# Altium schematic sheet MAIN-MODULE.SchDoc
size A; SheetNumber: 1; SheetTotal: 8
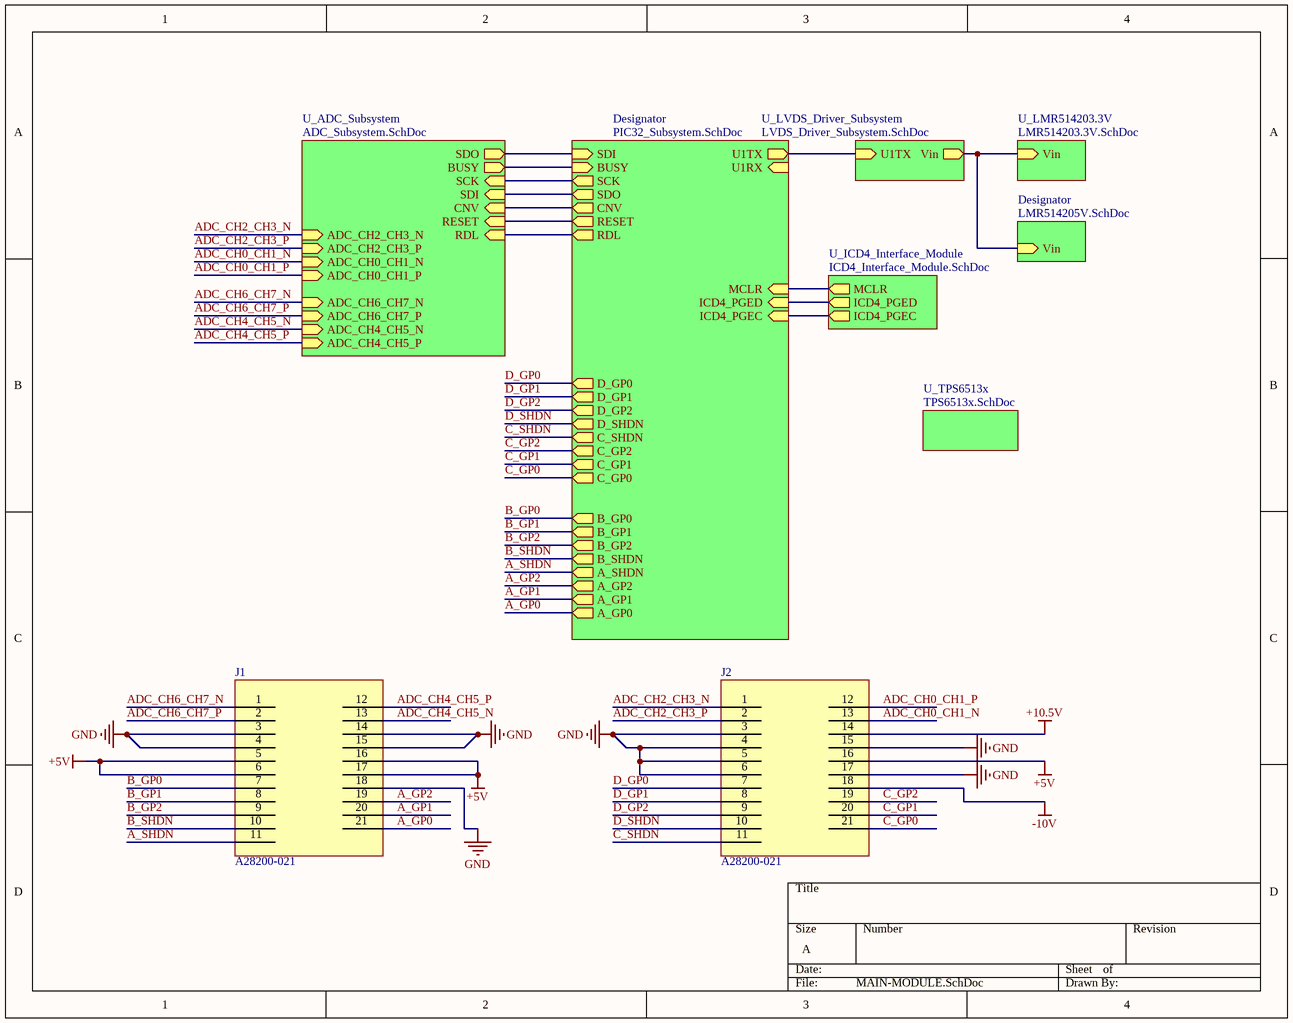
[diagram p0: MAIN-MODULE.SchDoc]

## Parts
J1  A28200-021  [A28200-021]
J2  A28200-021  [A28200-021]

## Sub-sheets
Designator = PIC32_Subsystem.SchDoc: ICD4_PGED (in), ICD4_PGEC (in), MCLR (in), SCK (out), U1RX (in), SDO (out), RESET (out), SDI (in), U1TX (out), BUSY (in), CNV (out), RDL (out), C_GP1 (out), C_GP2 (out), C_GP0 (out), C_SHDN (out), A_GP2 (out), A_GP0 (out), A_GP1 (out), A_SHDN (out), D_SHDN (out), D_GP0 (out), D_GP1 (out), D_GP2 (out), B_GP0 (out), B_GP1 (out), B_GP2 (out), B_SHDN (out)
Designator = LMR514205V.SchDoc: Vin (in)
U_ADC_Subsystem = ADC_Subsystem.SchDoc: SDO (out), SCK (in), SDI (in), BUSY (out), CNV (in), RESET (in), RDL (in), ADC_CH6_CH7_P (in), ADC_CH6_CH7_N (in), ADC_CH4_CH5_P (in), ADC_CH4_CH5_N (in), ADC_CH2_CH3_N (in), ADC_CH2_CH3_P (in), ADC_CH0_CH1_N (in), ADC_CH0_CH1_P (in)
U_ICD4_Interface_Module = ICD4_Interface_Module.SchDoc: MCLR (out), ICD4_PGED (out), ICD4_PGEC (out)
U_LMR514203.3V = LMR514203.3V.SchDoc: Vin (in)
U_LVDS_Driver_Subsystem = LVDS_Driver_Subsystem.SchDoc: U1TX (in), Vin (out)
U_TPS6513x = TPS6513x.SchDoc: no entries

## Nets
+5V: J1.5 J1.6 J1.16 J1.17 J2.16
+10.5V: J2.14
-10V: J2.18
GND: J1.3 J1.4 J1.14 J1.15 J1.18 J2.3 J2.4 J2.5 J2.6 J2.15 J2.17
A_GP0: J1.21 ; sheet Designator/A_GP0
A_GP1: J1.20 ; sheet Designator/A_GP1
A_GP2: J1.19 ; sheet Designator/A_GP2
A_SHDN: J1.11 ; sheet Designator/A_SHDN
ADC_CH0_CH1_N: J2.13 ; sheet U_ADC_Subsystem/ADC_CH0_CH1_N
ADC_CH0_CH1_P: J2.12 ; sheet U_ADC_Subsystem/ADC_CH0_CH1_P
ADC_CH2_CH3_N: J2.1 ; sheet U_ADC_Subsystem/ADC_CH2_CH3_N
ADC_CH2_CH3_P: J2.2 ; sheet U_ADC_Subsystem/ADC_CH2_CH3_P
ADC_CH4_CH5_N: J1.13 ; sheet U_ADC_Subsystem/ADC_CH4_CH5_N
ADC_CH4_CH5_P: J1.12 ; sheet U_ADC_Subsystem/ADC_CH4_CH5_P
ADC_CH6_CH7_N: J1.1 ; sheet U_ADC_Subsystem/ADC_CH6_CH7_N
ADC_CH6_CH7_P: J1.2 ; sheet U_ADC_Subsystem/ADC_CH6_CH7_P
B_GP0: J1.7 ; sheet Designator/B_GP0
B_GP1: J1.8 ; sheet Designator/B_GP1
B_GP2: J1.9 ; sheet Designator/B_GP2
B_SHDN: J1.10 ; sheet Designator/B_SHDN
C_GP0: J2.21 ; sheet Designator/C_GP0
C_GP1: J2.20 ; sheet Designator/C_GP1
C_GP2: J2.19 ; sheet Designator/C_GP2
C_SHDN: J2.11 ; sheet Designator/C_SHDN
D_GP0: J2.7 ; sheet Designator/D_GP0
D_GP1: J2.8 ; sheet Designator/D_GP1
D_GP2: J2.9 ; sheet Designator/D_GP2
D_SHDN: J2.10 ; sheet Designator/D_SHDN
(unnamed): sheet Designator/ICD4_PGED, sheet U_ICD4_Interface_Module/ICD4_PGED
(unnamed): sheet Designator/ICD4_PGEC, sheet U_ICD4_Interface_Module/ICD4_PGEC
(unnamed): sheet Designator/MCLR, sheet U_ICD4_Interface_Module/MCLR
(unnamed): sheet Designator/SCK, sheet U_ADC_Subsystem/SCK
(unnamed): sheet Designator/SDO, sheet U_ADC_Subsystem/SDI
(unnamed): sheet Designator/RESET, sheet U_ADC_Subsystem/RESET
(unnamed): sheet Designator/SDI, sheet U_ADC_Subsystem/SDO
(unnamed): sheet Designator/U1TX, sheet U_LVDS_Driver_Subsystem/U1TX
(unnamed): sheet Designator/BUSY, sheet U_ADC_Subsystem/BUSY
(unnamed): sheet Designator/CNV, sheet U_ADC_Subsystem/CNV
(unnamed): sheet Designator/RDL, sheet U_ADC_Subsystem/RDL
(unnamed): sheet U_LMR514203.3V/Vin, sheet U_LVDS_Driver_Subsystem/Vin, sheet Designator/Vin

## Library data of the parts
J1 J2 = A28200-021: CONN NANO-D PLUG 21POS SMD SLDR